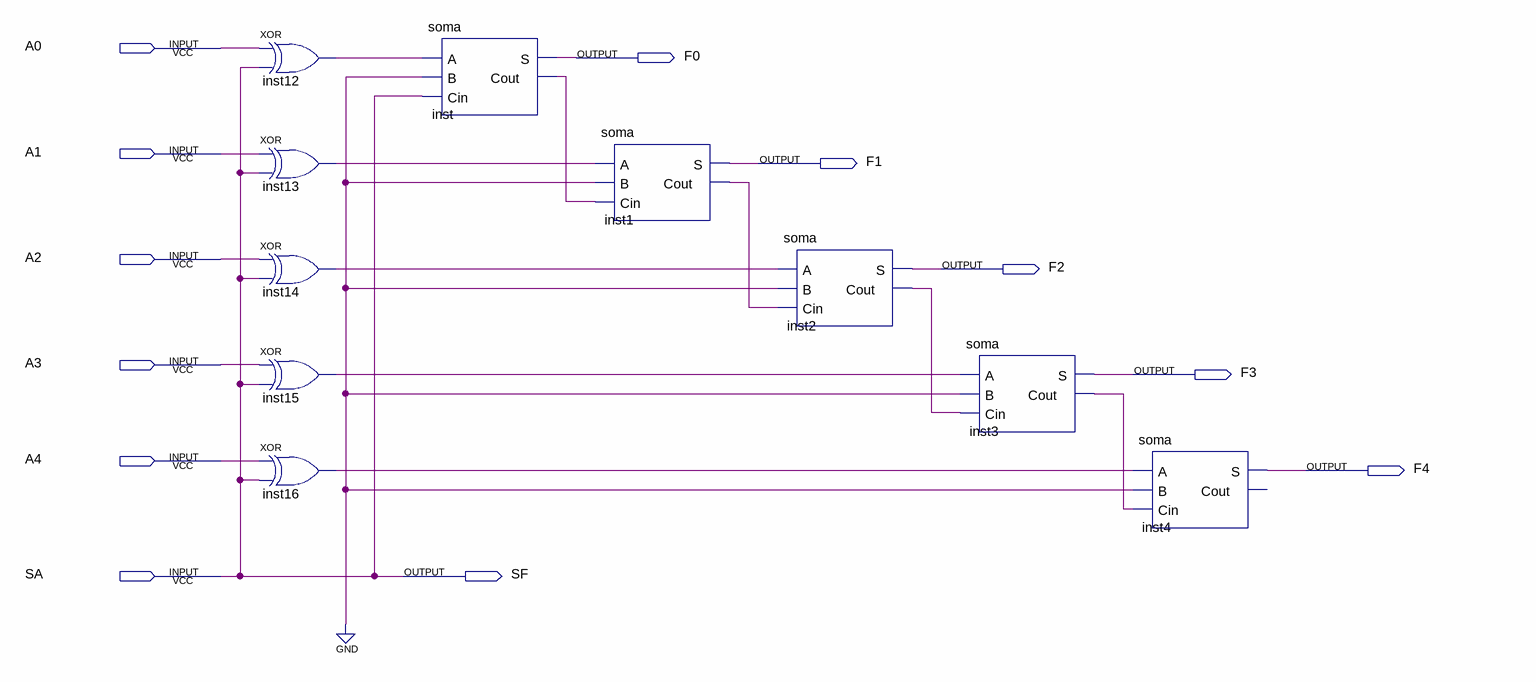
[diagram p0: schematic sheet]
// Quartus schematic complementa2.bdf as structural Verilog: 10 symbols, 12 pins
module complementa2 (
  input  A0,
  input  A1,
  input  A2,
  input  A3,
  input  A4,
  input  SA,
  output F0,
  output F1,
  output F2,
  output F3,
  output F4,
  output SF
);

  wire inst1_cout, inst2_cout, inst3_cout, inst12_out, inst13_out, inst14_out, inst15_out, inst16_out,
       inst_cout;

  xor inst12 (inst12_out, A0, SA);
  xor inst13 (inst13_out, A1, SA);
  xor inst14 (inst14_out, A2, SA);
  xor inst15 (inst15_out, A3, SA);
  xor inst16 (inst16_out, A4, SA);
  soma inst (.A(inst12_out), .B(1'b0), .Cin(SA), .S(F0), .Cout(inst_cout));
  soma inst1 (.A(inst13_out), .B(1'b0), .Cin(inst_cout), .S(F1), .Cout(inst1_cout));
  soma inst2 (.A(inst14_out), .B(1'b0), .Cin(inst1_cout), .S(F2), .Cout(inst2_cout));
  soma inst3 (.A(inst15_out), .B(1'b0), .Cin(inst2_cout), .S(F3), .Cout(inst3_cout));
  soma inst4 (.A(inst16_out), .B(1'b0), .Cin(inst3_cout), .S(F4));  // open: Cout

  assign SF = SA;
endmodule
